# Altium schematic sheet [03] - POWER SUPPLY.SchDoc
size A4; DocumentNumber: 3; SheetNumber: 3; SheetTotal: 4
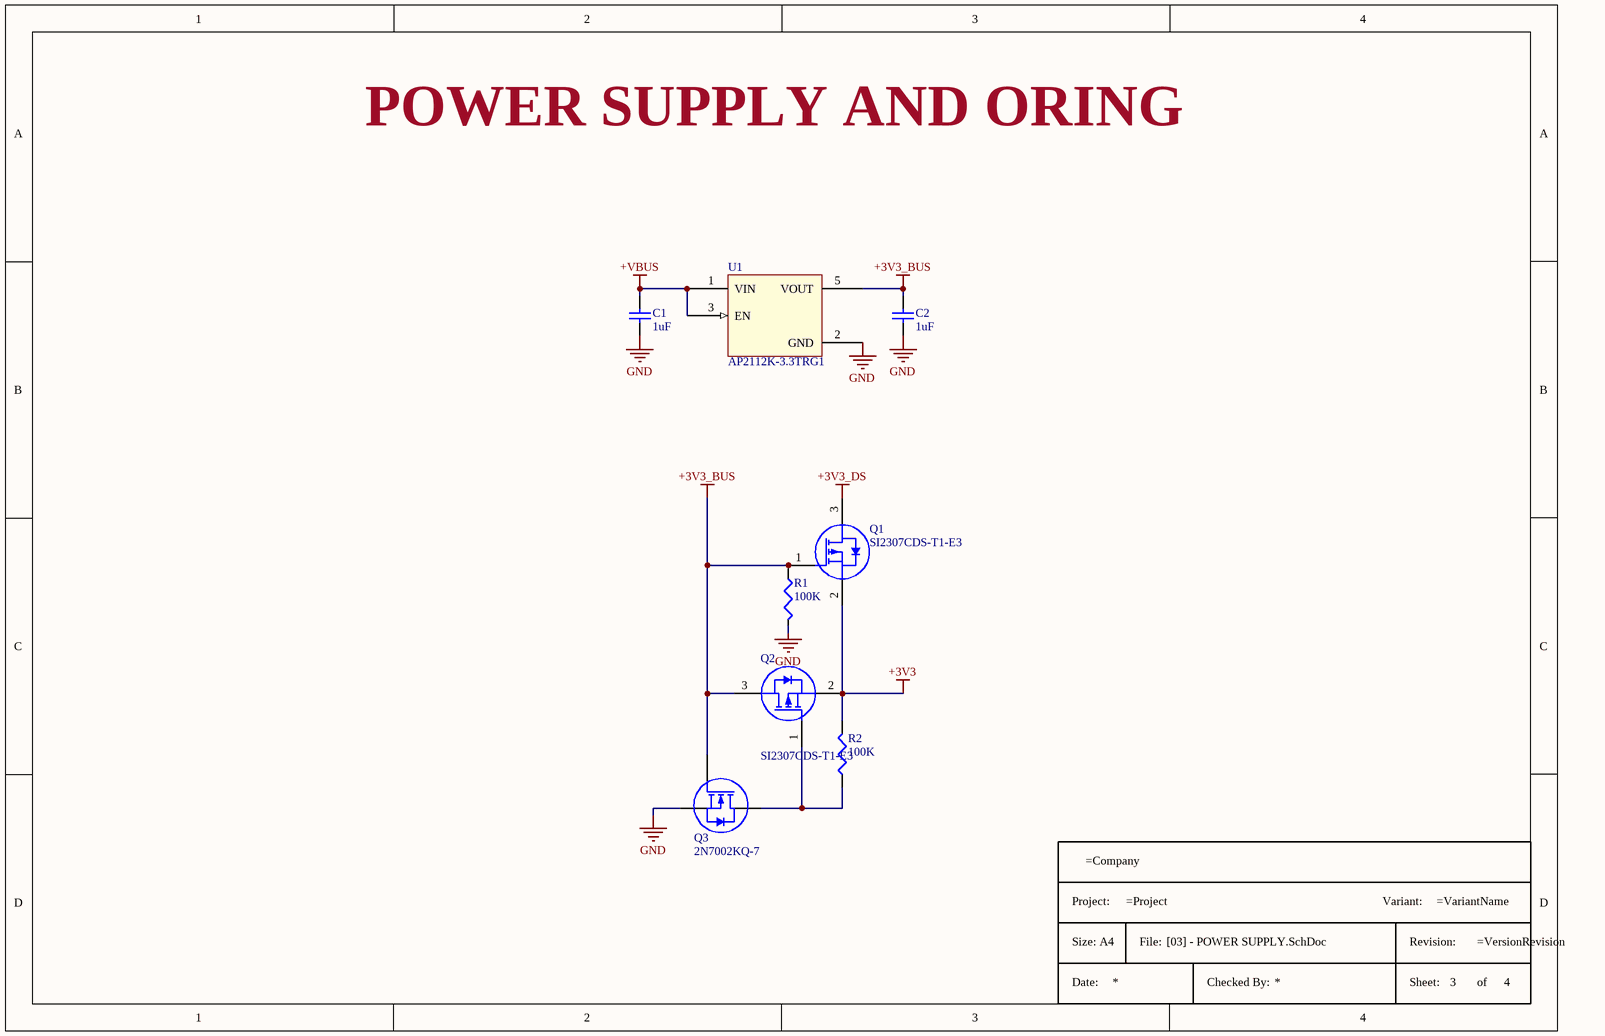
[diagram p0: [03] - POWER SUPPLY.SchDoc]

## Parts
*?  Title Block A4  (value not drawn)  (graphical)
C1  1uF  [C0402]
C2  1uF  [C0402]
Q1  SI2307CDS-T1-E3  [SOT-23_L2.9-W1.3-P1.90-LS2.4-BR]
Q2  SI2307CDS-T1-E3  [SOT-23_L2.9-W1.3-P1.90-LS2.4-BR]
Q3  2N7002KQ-7  [SOT-23_L2.9-W1.3-P1.90-LS2.4-BR]
R1  100K  [R0402]
R2  100K  [R0402]
U1  AP2112K-3.3TRG1  [SOT95P285X140-5N]

## Nets
+3V3: Q1.2(S) Q2.2(S) R2.2
+3V3_BUS: C2.2 Q1.1(G) Q2.3(D) Q3.1(G) R1.1 U1.5(VOUT)
+3V3_DS: Q1.3(D)
+VBUS: C1.2 U1.1(VIN) U1.3(EN)
GND: C1.1 C2.1 Q3.2(S) R1.2 U1.2(GND)
NetQ2_1: Q2.1(G) Q3.3(D) R2.1

## Notes on the sheet
- POWER SUPPLY AND ORING
- (in symbol Title Block A4) Project:; Variant:; Size: A4; File:; Revision:; Date:; Checked By:; Sheet:; of

## Library data of the parts
C1 C2 = C1005X5R1E105K050BC: TDK - C1005X5R1E105K050BC - COND, CERÁ MULT, X5R, 1UF, 25V, 0402; Dielectric Material: Ceramic; Tolerance: 10%; Supplier 1: Farnell; Supplier Part Number 1: 2346884; RoHS: YES; Stock: 131328; Pricing: 10=0,0948, 100=0,0638, 500=0,0468, 2500=0,0336, 5000=0,028, 10000=0,021, 50000=0,0175, 100000=0,0153 (EUR); ComponentLink1URL: http://www.farnell.com/datasheets/1796654.pdf; ComponentLink1Description: http://www.farnell.com/datasheets/1796654.pdf; .PCBCheck: *; .SCHCheck: *; Supplier 2: RSComponents; Supplier 3: Mouser; Supplier 4: Digi-Key; Supplier Part Number 2: 1110310; Supplier Part Number 3: 810-C1005X5R1E105K; Supplier Part Number 4: 445-9066-1-ND; Storage Location: C1-F2; Manufacturer: TDK; Manufacturer Part Number: C1005X5R1E105K050BC; Mount: Surface Mount; Case/Package: 0402; Weight: 2.3E-05oz; Case Code (Metric): 1005; Case Code (Imperial): 0402; Min Operating Temperature: -55°C; Max Operating Temperature: 85°C; Packaging: Tape and Reel; Capacitance: 1uF; Voltage Rating: 25V; Termination: SMD/SMT; Package Quantity: 1; Voltage Rating (DC): 25V; Dielectric: X5R; Composition: Ceramic; Length: 1mm; Height: 0.5mm; Width: 0.02inch; Thickness: 0.022inch; Depth: 0.5mm; Radiation Hardening: No; REACH SVHC: No SVHC; Lead Free: Lead Free
Q1 Q2 = SI2307CDS-T1-E3: P-Channel 30 V 3.5A (Tc) 1.1W (Ta), 1.8W (Tc) Surface Mount SOT-23-3 (TO-236); Number of Elements: 1; Package Body Material: Plastic; JEDEC-95 Code: TO-236AB; Transistor Application: SWITCHING; FET Technology: METAL-OXIDE SEMICONDUCTOR; Drain-source On Resistance-Max: 88mR; DS Breakdown Voltage-Min: 30V; Qualification Status: Not Qualified; Transistor Element Material: SILICON; Operating Mode: ENHANCEMENT MODE; Time @ Peak Reflow Temperature-Max (s): 30s; JESD-30 Code: R-PDSO-G3; Moisture Sensitivity Level: 1; Terminal Finish: Tin; Max Operating Temperature: 150°C; Power Dissipation-Max (Abs): 1.8W; Package Shape: Rectangular; Surface Mount: Yes; Case/Package: SOT23-3; JESD-609 Code: e3; Polarity/Channel Type: P-CHANNEL; Peak Reflow Temperature (Cel): 260°C; Terminal Position: DUAL; Drain Current-Max (Abs) (ID): 3.5A; REACH SVHC: Yes; RoHS Compliant: Yes; Package Style: SMALL OUTLINEMeter; Number of Pins: 3; Drain Current-Max (ID): 3.5A; Terminal Form: Gull Wing; Value: SI2307CDS-T1-E3
Q3 = 2N7002KQ-7: MOSFETs SOT-23; Manufacturer: Diodes Zetex; Rise Time: 3.4ns; Continuous Drain Current (ID): 380mA; Number of Elements: 1; Power Dissipation: 540mW; Turn-On Delay Time: 3.9ns; Turn-Off Delay Time: 15.7ns; Fall Time: 9.9ns; Gate to Source Voltage (Vgs): 20V; Supplier 1: Arrow Electronics; Manufacturer Part Number: 2N7002KQ-7; RoHS: Yes; Category: MOSFETs; Stock 1: 3000; Pricing 1: 1=0,05830, 10=0,05770, 25=0,05710, 100=0,05650, 250=0,05600, 500=0,05540, 1000=0,05490, 3000=0,02680 (USD); Mount: Surface Mount; Case/Package: SOT-23; Number of Pins: 3; Contact Plating: Tin,Matte; Min Operating Temperature: -55°C; Max Operating Temperature: 150°C; Packaging: Tape and Reel; Radiation Hardening: No; Reach SVHC Compliant: Yes; RoHS Compliant: Yes; ComponentLink1URL: https://datasheet.ciiva.com/30023/ds30896-30023832.pdf?src-supplier=Avnet; ComponentLink1Description: https://datasheet.ciiva.com/30023/ds30896-30023832.pdf?src-supplier=Avnet; Supplier Part Number 1: 2N7002KQ-7
R1 R2 = CRCW0402100KFKED: RES SMD 100K OHM 1% 1/16W 0402; Manufacturer: Vishay; Resistance: 100kR; Temperature Coefficient: 100ppm/°C; Power Rating: 63mW; Voltage Rating: 50V; Supplier 1: Farnell; Manufacturer Part Number: CRCW0402100KFKED; Stock 1: 168772; Pricing 1: 10=0.0216, 100=0.0151, 500=0.0077, 2500=0.0058, 5000=0.0046 (GBP); Mount: Surface Mount; Case/Package: 0402; Number of Pins: 2; Weight: 2.3E-05oz; Contact Plating: Tin; Case Code (Metric): 1005; Case Code (Imperial): 0402; Min Operating Temperature: -55°C; Max Operating Temperature: 155°C; Tolerance: 1%; Composition: Thick Film; Termination: SMD/SMT; Packaging: Tape and Reel; Package Quantity: 10000; Number of Terminations: 2; Max Power Dissipation: 63mW; Voltage Rating (DC): 50V; Military Standard: Not; Length: 1mm; Height: 0.35mm; Width: 0.02inch; Depth: 0.5mm; Radiation Hardening: No; Lead Free: Lead Free; REACH SVHC: Unknown; ComponentLink1URL: https://datasheet.ciiva.com/11810/0900766b80d98824-11810752.pdf; ComponentLink1Description: https://datasheet.ciiva.com/11810/0900766b80d98824-11810752.pdf; ComponentLink2URL: https://datasheet.ciiva.com/26316/fld-crcw-e3-data-en-26316630.pdf; ComponentLink2Description: https://datasheet.ciiva.com/26316/fld-crcw-e3-data-en-26316630.pdf; ComponentLink3URL: https://datasheet.ciiva.com/2463/dcrcwe3-2463064.pdf; ComponentLink3Description: https://datasheet.ciiva.com/2463/dcrcwe3-2463064.pdf; ComponentLink4URL: https://datasheet.ciiva.com/2463/dcrcwe3-2463065.pdf; ComponentLink4Description: https://datasheet.ciiva.com/2463/dcrcwe3-2463065.pdf; ComponentLink5URL: https://datasheet.ciiva.com/16776/70201119-16776281.pdf; ComponentLink5Description: https://datasheet.ciiva.com/16776/70201119-16776281.pdf; ComponentLink6URL: https://datasheet.ciiva.com/16941/dcrcwe3-16941129.pdf; ComponentLink6Description: https://datasheet.ciiva.com/16941/dcrcwe3-16941129.pdf; ComponentLink7URL: https://datasheet.ciiva.com/2463/dcrcwe3-2463066.pdf; ComponentLink7Description: https://datasheet.ciiva.com/2463/dcrcwe3-2463066.pdf; ComponentLink8URL: https://datasheet.ciiva.com/3255/dcrcwe3-3255947.pdf; ComponentLink8Description: https://datasheet.ciiva.com/3255/dcrcwe3-3255947.pdf; ComponentLink9URL: https://datasheet.ciiva.com/3255/dcrcwe3-3255948.pdf; ComponentLink9Description: https://datasheet.ciiva.com/3255/dcrcwe3-3255948.pdf; ComponentLink10URL: https://datasheet.ciiva.com/16208/dcrcwe3-16208508.pdf; ComponentLink10Description: https://datasheet.ciiva.com/16208/dcrcwe3-16208508.pdf; ComponentLink11URL: https://datasheet.ciiva.com/5546/dcrcwe3-109170-5546638.pdf; ComponentLink11Description: https://datasheet.ciiva.com/5546/dcrcwe3-109170-5546638.pdf; ComponentLink12URL: https://datasheet.ciiva.com/46441/1720486-46441598.pdf; ComponentLink12Description: https://datasheet.ciiva.com/46441/1720486-46441598.pdf; Supplier Part Number 1: 1469671; Supplier 2: RSComponents; Supplier 3: Mouser; Supplier 4: Digi-Key; Supplier Part Number 2: 6784684; Supplier Part Number 3: 71-CRCW0402-100K-E3; Supplier Part Number 4: 541-100KLCT-ND; Storage Location: C5-K3
U1 = AP2112K-3.3TRG1: IC REG LDO 3.3V 0.6A SOT25; Manufacturer: Diodes; Min Input Voltage: 2.5V; Number of Outputs: 1; Dropout Voltage: 250mV; Max Input Voltage: 6V; Output Current: 600mA; Quiescent Current: 55uA; Polarity: Positive; Accuracy: 1.5%; Output Type: Fixed; Supplier 1: Future Electronics; Manufacturer Part Number: AP2112K-3.3TRG1; RoHS: Yes; Category: Voltage Regulators - Linear; Stock 1: 456000; Pricing 1: 3000=0,12700, 9000=0,12400, 15000=0,12200, 60000=0,11800, 90000=0,11500 (USD); Mount: Surface Mount; Case/Package: SOT-23-5; Number of Pins: 5; Min Operating Temperature: -40°C; Max Operating Temperature: 85°C; Package Quantity: 1; Packaging: Tape and Reel; Output Voltage: 3.3V; Number of Regulators: 1; Max Output Current: 600mA; Length: 3.1mm; Width: 1.7mm; Height: 1.3mm; Lead Free: Lead Free; RoHS Compliant: Yes; ComponentLink1URL: https://datasheet.ciiva.com/30016/ap2112-30016792.pdf?src-supplier=Avnet; ComponentLink1Description: https://datasheet.ciiva.com/30016/ap2112-30016792.pdf?src-supplier=Avnet; ComponentLink2URL: https://datasheet.ciiva.com/29569/ap2112-29569918.pdf?src-supplier=Digi-Key; ComponentLink2Description: https://datasheet.ciiva.com/29569/ap2112-29569918.pdf?src-supplier=Digi-Key; ComponentLink3URL: https://datasheet.ciiva.com/29569/ap2112-29569919.pdf?src-supplier=Digi-Key; ComponentLink3Description: https://datasheet.ciiva.com/29569/ap2112-29569919.pdf?src-supplier=Digi-Key; ComponentLink4URL: https://datasheet.ciiva.com/29569/ap2112-29569917.pdf?src-supplier=Digi-Key; ComponentLink4Description: https://datasheet.ciiva.com/29569/ap2112-29569917.pdf?src-supplier=Digi-Key; Supplier Part Number 1: 8043011